# EAGLE design struktable_trigger_shield_revc (EAGLE 5.06)
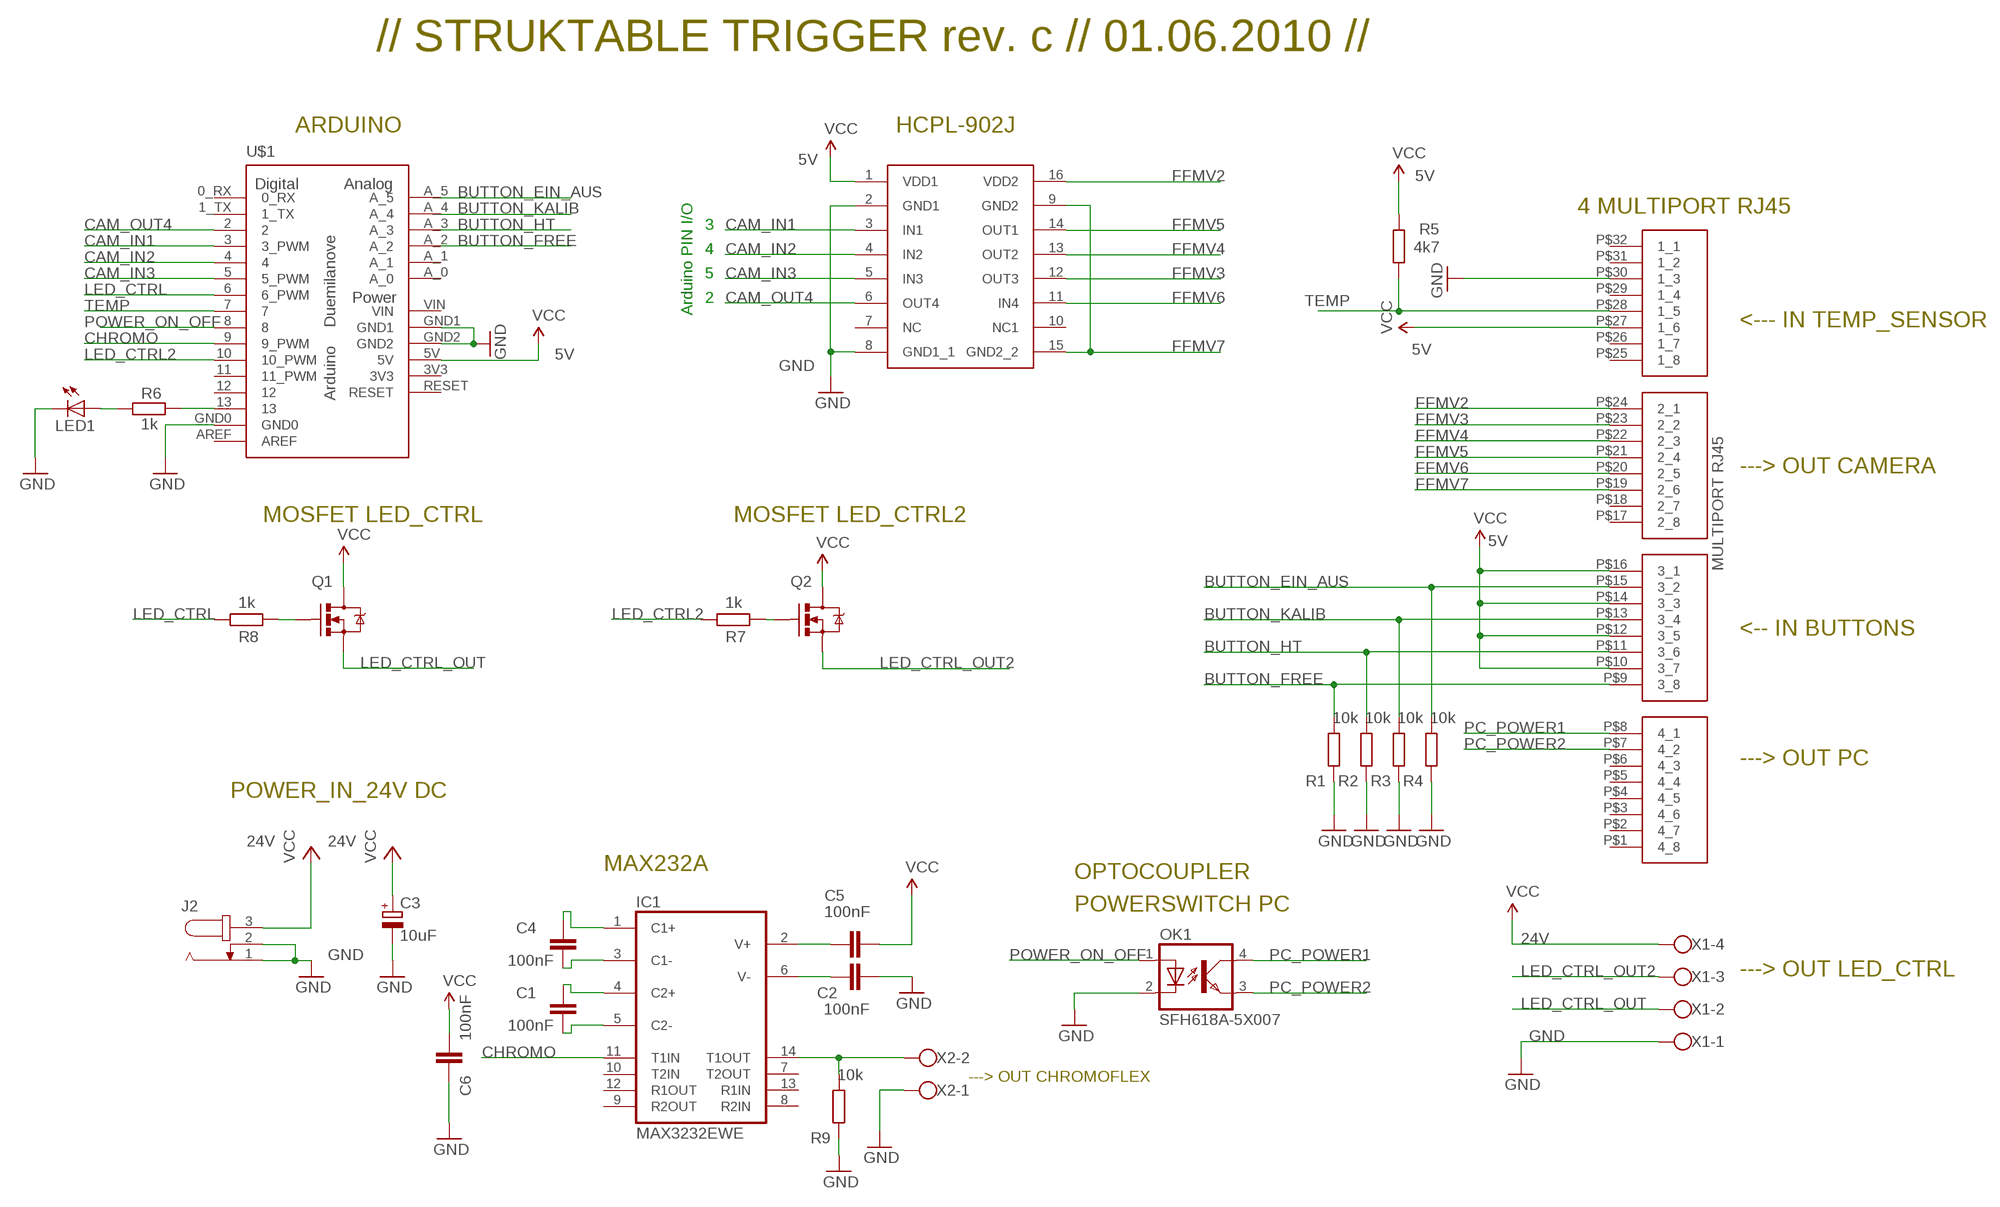
[diagram p0: schematic, sheet 1]

## Parts
C1  100nF  C-EUC0805  [C0805]
C2  100nF  C-EUC0805  [C0805]
C3  10uF  CPOL-EUSMCC  [SMC_C]
C4  100nF  C-EUC0805  [C0805]
C5  100nF  C-EUC0805  [C0805]
C6  100nF  C-EUC0805  [C0805]
IC1  MAX3232EWE  [SO16L]
IC2  HCPL-902J  [SOIC16]
J2  JACK-PLUG0  [SPC4077]
LED1  LED0603  [LED-0603]
OK1  SFH618A-5X007  [SMD4-7]
PORT1  4PORT_ETHERNET  [4PORT_ETHERNET]
Q1  MOSFET-NCHANNELSMD  [SOT23-3]
Q2  MOSFET-NCHANNELSMD  [SOT23-3]
R1  10k  R-EU_R0805  [R0805]
R2  10k  R-EU_R0805  [R0805]
R3  10k  R-EU_R0805  [R0805]
R4  10k  R-EU_R0805  [R0805]
R5  4k7  R-EU_R0805  [R0805]
R6  1k  R-EU_R0805  [R0805]
R7  1k  R-EU_R0805  [R0805]
R8  1k  R-EU_R0805  [R0805]
R9  10k  R-EU_R0805  [R0805]
U$1  ARDUINO-USBNO-OUTLINE-NO-TEXT-OCTAGONAL  [NO-OUTLINE-OCTAGONAL-NOTEXT]
X1  W237-04P  [W237-4P]
X2  W237-102  [W237-102]

## Nets
5V: C5.1 C6.2 IC2.1(VDD1) PORT1.P$10(3_7) PORT1.P$12(3_5) PORT1.P$14(3_3) PORT1.P$16(3_1) PORT1.P$27(1_6) Q1.3(D) Q2.3(D) R5.2 U$1.5V ; supply symbol labelled VCC
24V: C3.+ J2.3 X1.4 ; supply symbol labelled VCC
BUTTON_EIN_AUS: PORT1.P$15(3_2) R4.2 U$1.A_5
BUTTON_FREE: PORT1.P$9(3_8) R1.2 U$1.A_2
BUTTON_HT: PORT1.P$11(3_6) R2.2 U$1.A_3
BUTTON_KALIB: PORT1.P$13(3_4) R3.2 U$1.A_4
CAM_IN1: IC2.3(IN1) U$1.3(3_PWM)
CAM_IN2: IC2.4(IN2) U$1.4
CAM_IN3: IC2.5(IN3) U$1.5(5_PWM)
CAM_OUT4: IC2.6(OUT4) U$1.2
CHROMO: IC1.11(T1IN) U$1.9(9_PWM)
FFMV2: IC2.16(VDD2) PORT1.P$24(2_1)
FFMV3: IC2.12(OUT3) PORT1.P$23(2_2)
FFMV4: IC2.13(OUT2) PORT1.P$22(2_3)
FFMV5: IC2.14(OUT1) PORT1.P$21(2_4)
FFMV6: IC2.11(IN4) PORT1.P$20(2_5)
FFMV7: IC2.9(GND2) IC2.15(GND2_2) PORT1.P$19(2_6)
GND: C2.2 C3.- C6.1 IC2.2(GND1) IC2.8(GND1_1) J2.1 J2.2 LED1.C OK1.2(C) PORT1.P$30(1_3) R1.1 R2.1 R3.1 R4.1 R9.1 U$1.GND0 U$1.GND1 U$1.GND2 X1.1 X2.1
LED_CTRL: R8.2 U$1.6(6_PWM)
LED_CTRL2: R7.2 U$1.10(10_PWM)
LED_CTRL_OUT: Q1.2(S) X1.2
LED_CTRL_OUT2: Q2.2(S) X1.3
N$1: C4.1 IC1.1(C1+)
N$5: R6.1 U$1.13
N$6: LED1.A R6.2
N$10: Q2.1(G) R7.1
N$11: C5.2 IC1.2(V+)
N$15: C2.1 IC1.6(V-)
N$16: Q1.1(G) R8.1
N$17: C4.2 IC1.3(C1-)
N$18: C1.1 IC1.4(C2+)
N$19: C1.2 IC1.5(C2-)
N$20: IC1.14(T1OUT) R9.2 X2.2
PC_POWER1: OK1.4(COL) PORT1.P$8(4_1)
PC_POWER2: OK1.3(EMIT) PORT1.P$7(4_2)
POWER_ON_OFF: OK1.1(A) U$1.8
TEMP: PORT1.P$28(1_5) R5.1 U$1.7
Unconnected: IC1.7(T2OUT) IC1.8(R2IN) IC1.9(R2OUT) IC1.10(T2IN) IC1.12(R1OUT) IC1.13(R1IN) IC2.7(NC) IC2.10(NC1) PORT1.P$1(4_8) PORT1.P$2(4_7) PORT1.P$3(4_6) PORT1.P$4(4_5) PORT1.P$5(4_4) PORT1.P$6(4_3) PORT1.P$17(2_8) PORT1.P$18(2_7) PORT1.P$25(1_8) PORT1.P$26(1_7) PORT1.P$29(1_4) PORT1.P$31(1_2) PORT1.P$32(1_1) U$1.0_RX U$1.1_TX U$1.11(11_PWM) U$1.12 U$1.A_0 U$1.A_1 U$1.AREF U$1.RESET

## Notes on the sheet
- // STRUKTABLE TRIGGER rev. c // 01.06.2010 //
- ARDUINO | HCPL-902J
- 4 MULTIPORT RJ45
- 3
- 4
- 5
- 2
- Arduino PIN I/O
- <--- IN TEMP_SENSOR
- ---> OUT CAMERA
- MOSFET LED_CTRL | MOSFET LED_CTRL2
- <-- IN BUTTONS
- ---> OUT PC
- POWER_IN_24V DC
- MAX232A
- OPTOCOUPLER
- POWERSWITCH PC
- ---> OUT LED_CTRL
- ---> OUT CHROMOFLEX

## Power pins joined to a net without a drawn wire
3V3: U$1.3V3
24V: IC1.16(VCC)
GND: IC1.15(GND)
VIN: U$1.VIN

## Library data of the parts
C1 C2 C4-C6 = rcl:C-EU: CAPACITOR, European symbol
C3 = rcl:CPOL-EU: POLARIZED CAPACITOR, European symbol
IC1 = maxim:MAX3232*: True RS-232 Transceivers 3.0V to 5.5V, Low-Power up to 1Mbps, Using Four 0.1µF External Capacitors Source: http://pdfserv.maxim-ic.com/en/ds/MAX3222-MAX3241.pdf
IC2 = strukt:HCPL-902J
J2 = con-jack:JACK-PLUG: DC POWER JACK Power Jack, DC, Right Angle, Through Hole, Rated 5A at 16VDC, PC Terminals Distributor: Farnell (www.Farnell.de) Drawing: 84N1161.pdf / 84N1162.pdf Manufacturer: SPC Technology (www.spctechnology.com) Type: SPC4077 / SPC 4078
LED1 = SparkFun:LED: LEDs Standard schematic elements and footprints for 5mm, 3mm, 1206, and 0603 sized LEDs. 5mm - Spark Fun Electronics SKU : COM-00529 (and others)
OK1 = optocoupler:SFH618?*: Optocoupler, Phototransistor Output, Low Input Current Source: http://www.vishay.com/docs/83673/sfh618.pdf
PORT1 = strukt:4PORT_ETHERNET
Q1 Q2 = SparkFun:MOSFET-NCHANNEL
R1-R9 = rcl:R-EU_: RESISTOR, European symbol
U$1 = Arduino-Various:ARDUINO-USB: The Ardiuno Duemilanove Pinouts layoutet as a Bare Shield. v0.5 Also for Arduino Diecimila. This is designed as a Part and has no Outline in the Dimension Layer. The Outline, when present, is drawed at the tPlace / bPlace Layer. Library by Stephanie Lange, http://www.k-ita.de/~sl/
X1 = con-wago-508:W237-04P: WAGO SREW CLAMP
X2 = con-wago-500:W237-102: WAGO SCREW CLAMP

## Board
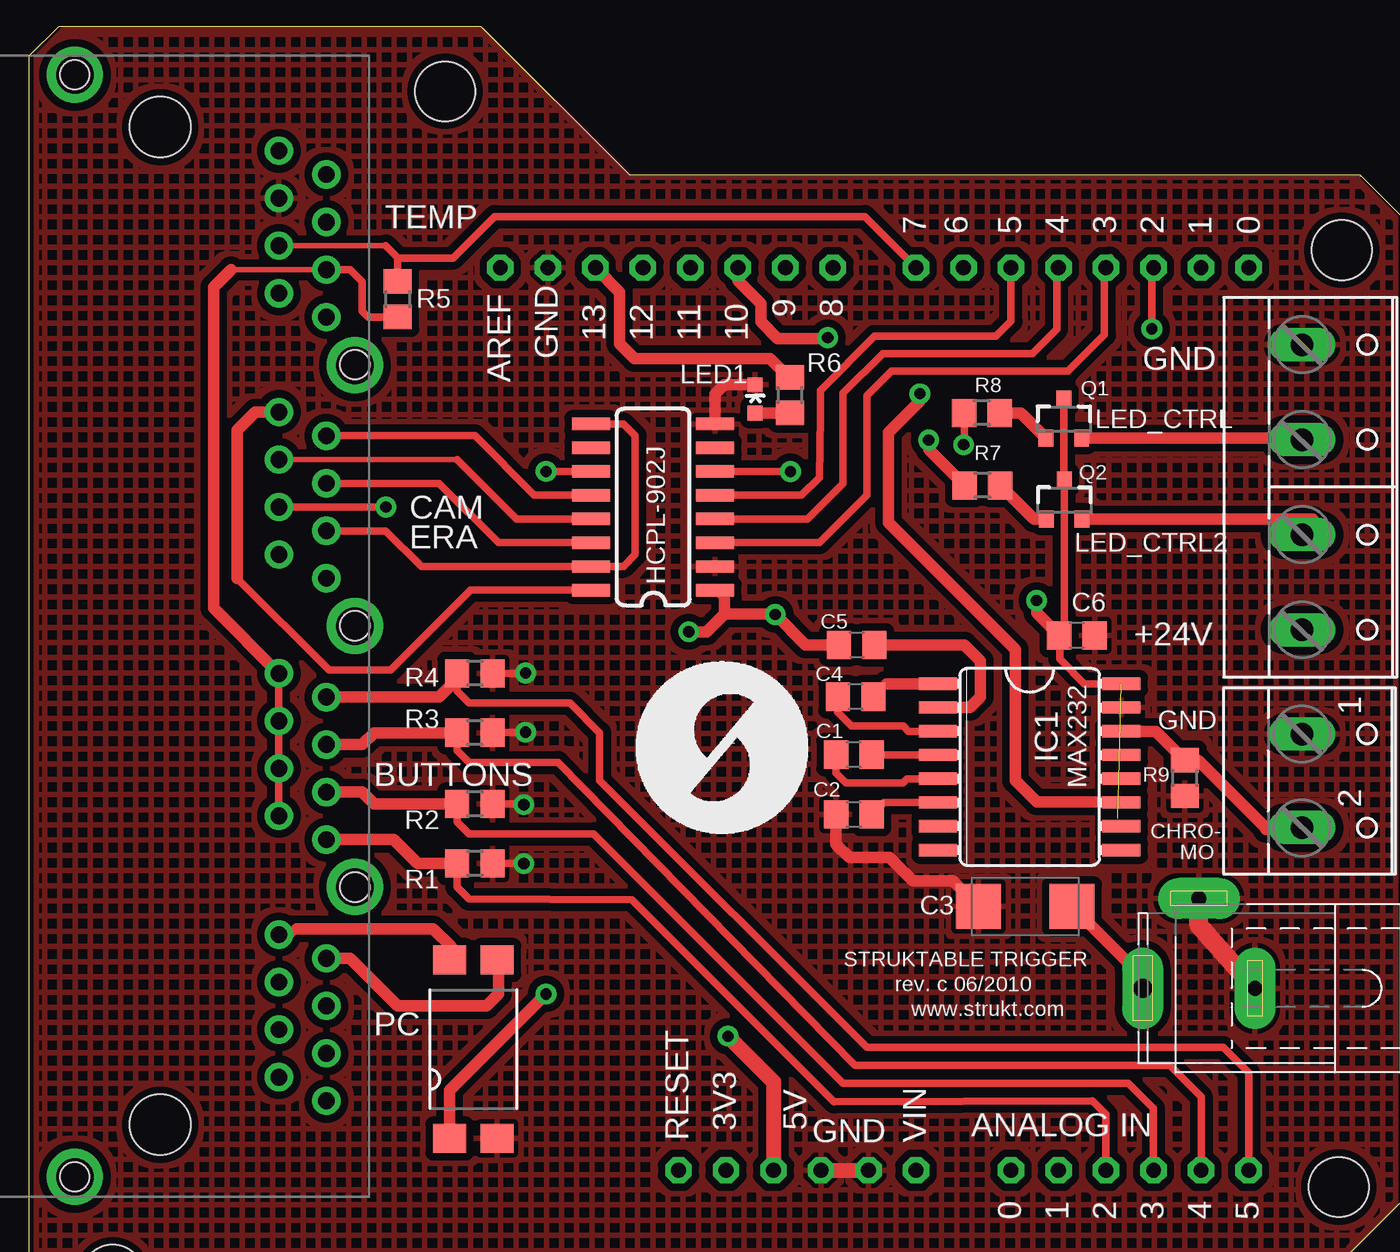
[diagram p1: board, top side]
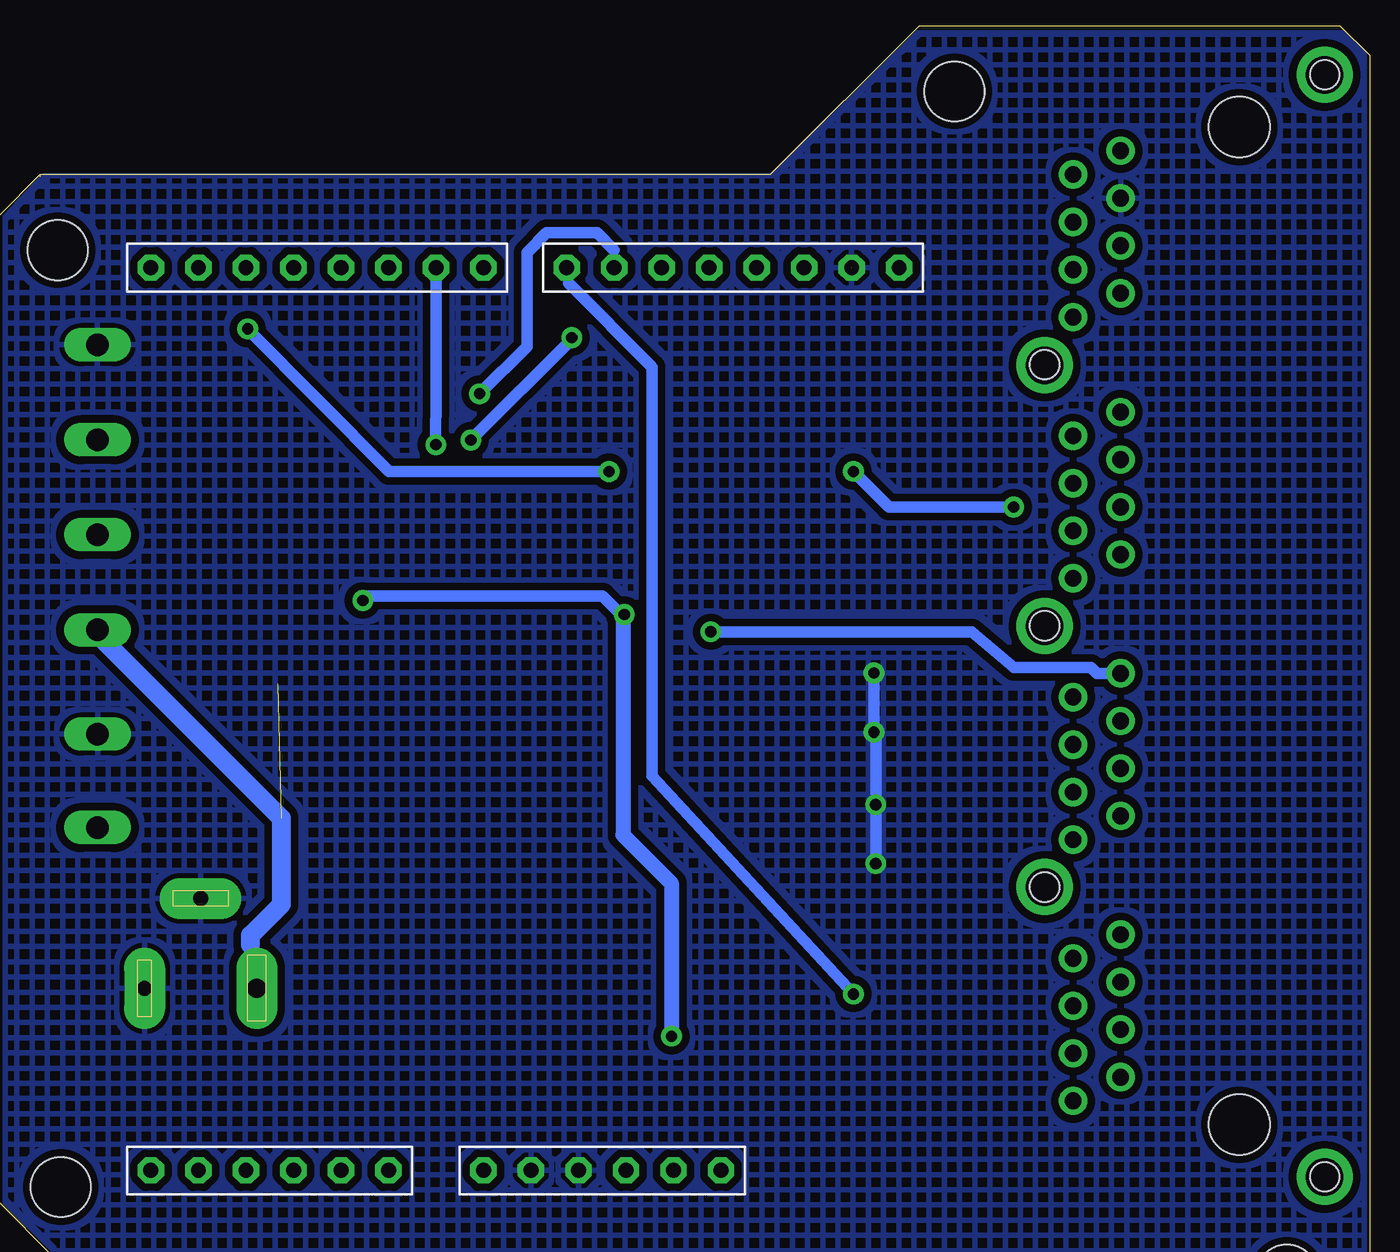
[diagram p2: board, bottom side, seen from below]

No outline drawn. Coordinates in mm, seen from the top.
Copper layers (1*16): Top 0.035mm / dielectric 1.5mm / Bottom 0.035mm
Design rules "SparkFun": minimum track width 8mil, minimum drill 20mil, track to track 8mil, track to pad 8mil, pad to pad 8mil, via to via 8mil, smd to smd 8mil, copper to edge 10mil, drill to drill 8mil, minimum pad ring 12mil, minimum via ring 10mil, stop-mask expansion 4mil, vias tented up to drill 25mil, thermal gap 10mil
Holes 3.2 mm at 22.23,66.04 70.17,57.55 70,7.46 4.45,2.78
Milling: 13 lines

### Footprints (pad centres in the part's own frame; a part is rotated, then mirrored left to right if it is on the bottom)
C0805 = smd 1.3 x 1.5: 1 -0.95,0; 2 0.95,0
SMC_C = smd 2.4 x 2.4: + -2.5,0; - 2.5,0
SO16L = smd 0.66 x 2.032: 1 -4.445,-4.902; 2 -3.175,-4.902; 3 -1.905,-4.902; 4 -0.635,-4.902; 5 0.635,-4.902; 6 1.905,-4.902; 7 3.175,-4.902; 8 4.445,-4.902; 9 4.445,4.902; 10 3.175,4.902; 11 1.905,4.902; 12 0.635,4.902; 13 -0.635,4.902; 14 -1.905,4.902; 15 -3.175,4.902; 16 -4.445,4.902
SOIC16 = smd 0.66 x 2.032: 1 -4.445,-3.315; 2 -3.175,-3.315; 3 -1.905,-3.315; 4 -0.635,-3.315; 5 0.635,-3.315; 6 1.905,-3.315; 7 3.175,-3.315; 8 4.445,-3.315; 9 4.445,3.315; 10 3.175,3.315; 11 1.905,3.315; 12 0.635,3.315; 13 -0.635,3.315; 14 -1.905,3.315; 15 -3.175,3.315; 16 -4.445,3.315
SPC4077 = drill 0.8 pad 2.184 long: 1 -3,0; 2 0,-4.8 | drill 1 pad 2.184 long: 3 3,0
LED-0603 = smd 0.8 x 0.8: A 0,-0.75; C 0,0.75
SMD4-7 = smd 1.78 x 1.55: 1 -1.27,-4.77; 2 1.27,-4.77; 3 1.27,4.77; 4 -1.27,4.77
4PORT_ETHERNET = drill 0.9 pad 1.422 round: P$1 25.4,8.89; P$2 24.13,6.35; P$3 22.86,8.89; P$4 21.59,6.35; P$5 20.32,8.89; P$6 19.05,6.35; P$7 17.78,8.89; P$8 16.51,6.35; P$9 11.43,8.89; P$10 10.16,6.35; P$11 8.89,8.89; P$12 7.62,6.35; P$13 6.35,8.89; P$14 5.08,6.35; P$15 3.81,8.89; P$16 2.54,6.35; P$17 -2.54,8.89; P$18 -3.81,6.35; P$19 -5.08,8.89; P$20 -6.35,6.35; P$21 -7.62,8.89; P$22 -8.89,6.35; P$23 -10.16,8.89; P$24 -11.43,6.35; P$25 -16.51,8.89; P$26 -17.78,6.35; P$27 -19.05,8.89; P$28 -20.32,6.35; P$29 -21.59,8.89; P$30 -22.86,6.35; P$31 -24.13,8.89; P$32 -25.4,6.35 | hole 3.25: -26.67,0; 26.67,0 | hole 1.57: -13.97,10.41; 0,10.41; 13.97,10.41; -29.46,-4.57; 29.46,-4.57
SOT23-3 = smd 0.8 x 0.9: 1 -0.95,-1; 2 0.95,-1; 3 0,1.1
R0805 = smd 1.3 x 1.5: 1 -0.95,0; 2 0.95,0
NO-OUTLINE-OCTAGONAL-NOTEXT = drill 0.8 pad 1.27 octagon: 0_RX -25.4,27.94; 1_TX -25.4,25.4; 2 -25.4,22.86; 3 -25.4,20.32; 3V3 22.86,0; 4 -25.4,17.78; 5 -25.4,15.24; 5V 22.86,2.54; 6 -25.4,12.7; 7 -25.4,10.16; 8 -25.4,5.715; 9 -25.4,3.175; 10 -25.4,0.635; 11 -25.4,-1.905; 12 -25.4,-4.445; 13 -25.4,-6.985; A_0 22.86,15.24; A_1 22.86,17.78; A_2 22.86,20.32; A_3 22.86,22.86; A_4 22.86,25.4; A_5 22.86,27.94; AREF -25.4,-12.065; GND0 -25.4,-9.525; GND1 22.86,7.62; GND2 22.86,5.08; RESET 22.86,-2.54; VIN 22.86,10.16
W237-4P = drill 1.194 long: 1 -7.62,-0.635; 2 -2.54,-0.635; 3 2.54,-0.635; 4 7.62,-0.635
W237-102 = drill 1.194 long: 1 -2.5,-1.27; 2 2.5,-1.27

### Placement (x,y rotation side)
C1  44.08,30.57 180 top
C2  44.08,27.38 180 top
C3  53.23,22.46 180 top
C4  44.17,33.67 180 top
C5  44.23,36.45 0 top
C6  56,36.95 180 top
IC1  53.48,29.93 270 top
IC2  33.34,43.81 90 top
J2  62.52,18.09 180 top
LED1  38.8,49.6 0 top
OK1  23.73,14.82 0 top
PORT1  6.99,37.47 270 top
Q1  55.3,48.5 0 top
Q2  55.33,44.17 0 top
R1  23.81,24.77 180 top
R2  23.81,27.94 180 top
R3  23.81,31.75 180 top
R4  23.81,34.92 180 top
R5  19.68,54.93 270 top
R6  40.65,49.8 270 top
R7  50.95,44.98 180 top
R8  50.92,48.85 180 top
R9  61.77,29.32 90 top
U$1  37.24,31.21 270 top
X1  68.67,44.88 270 top
X2  69.3,29.18 270 top

### Tracks (layer width: path | path; a pad name or v marks a point on that pad's centre or on a via)
5V  (via drill 0.6)
  Top 0.305: 10.79,56.52 PORT1.P$27
  Top 0.406: PORT1.P$10 PORT1.P$12 PORT1.P$14 PORT1.P$16 13.02,34.61 | 37.15,38.88 IC2.1 | R5.2 18.09,53.98 17.78,54.29 17.78,55.88 17.14,56.52 PORT1.P$27 | Q1.3 55.3,45.3 Q2.3 55.33,37.23 C6.2
  Top 0.61: PORT1.P$16 9.84,38.42 9.84,55.56 10.79,56.52 | v35.24,37.15 36.2,37.15 37.15,38.1 | 37.15,38.1 37.15,38.88 | 37.15,38.1 39.85,38.1 v39.88,38.08 41.5,36.45 C5.1 | v53.85,38.83 53.85,38.15 C6.2
  Top 0.813: U$1.5V 39.78,13.1 v37.35,15.53
  Bottom 0.406: v39.88,38.08 40.05,38.08 | 53.62,39.05 v53.85,38.83
  Bottom 0.61: PORT1.P$16 14.61,34.92 14.92,35.24 19.05,35.24 21.27,37.15 v35.24,37.15 | v39.88,38.08 39.95,38 | 40.05,38.08 41.02,39.05 53.62,39.05
  Bottom 0.813: v37.35,15.53 37.35,23.7 39.95,26.3 39.95,38
24V  (1 unrouted)
  Top 0.406: 59.43,18.36 J2.3 | IC1.16 56.41,34.37 55.08,35.7 55.08,36.83 54.98,36.92
  Top 0.61: 59.43,18.36 59.43,18.77 C3.+
  Bottom 0.61: 68.15,37.12 69.46,37.12 X1.4
  Bottom 0.813: J2.3 59.85,20.41
  Bottom 1.016: 59.85,20.41 59.85,20.93 58.2,22.57 58.2,27.18 68.15,37.12
BUTTON_EIN_AUS
  Top 0.406: R4.2 23.18,34.92 R4.2 | U$1.A_5 65.18,13.56 63.82,14.92 44.77,14.92 30.48,29.21 30.48,31.75 28.89,33.34 23.5,33.34 22.86,33.97 R4.2
  Top 0.61: PORT1.P$15 21.91,33.66 23.18,34.92
BUTTON_FREE
  Top 0.406: 23.18,24.77 R1.2 22.86,23.5 23.5,22.86 32.22,22.81 43.01,12.02 56.83,12.06 57.56,11.34 U$1.A_2
  Top 0.61: PORT1.P$9 19.48,26.04 20.75,24.77 R1.2
BUTTON_HT
  Top 0.406: U$1.A_3 60.1,11.66 58.74,13.02 43.5,13.02 30.16,26.35 23.5,26.35 22.86,26.99 22.86,27.62 23.18,27.94 R2.2
  Top 0.61: PORT1.P$11 17.78,28.57 18.41,27.94 R2.2
BUTTON_KALIB
  Top 0.406: U$1.A_4 62.64,12.29 60.96,13.97 44.13,13.97 28.26,30.16 23.5,30.16 22.86,30.8 22.86,31.43 23.18,31.75 R3.2
  Top 0.61: PORT1.P$13 17.78,31.11 18.41,31.75 R3.2
CAM_IN1
  Top 0.406: IC2.3 42.23,41.91 44.77,44.45 44.77,49.77 46.08,51.08 55.52,51.08 57.47,53.02 57.47,56.83 57.78,57.15 57.78,56.52 57.69,56.62 U$1.3
CAM_IN2
  Top 0.406: IC2.4 41.59,43.18 43.5,45.09 43.5,49.9 45.62,52.02 53.61,52.02 54.93,53.34 54.93,56.2 55.24,56.52 55.15,56.62 U$1.4
CAM_IN3
  Top 0.406: U$1.5 52.48,53.75 51.68,52.95 45.17,52.95 42.28,50.05 42.28,48.69 42.23,45.4 41.27,44.45 IC2.5 38.1,44.45
CAM_OUT4  (via drill 0.6)
  Top 0.406: IC2.6 40.64,45.72 v40.68,45.71 | v60.01,53.34 60.01,56.52 U$1.2
  Bottom 0.61: v40.68,45.71 52.43,45.71 v60.01,53.34
CHROMO  (via drill 0.6)
  Top 0.406: 47.6,49.48 v47.6,49.88 | IC1.11 58.35,28.05
  Top 0.61: 47.6,49.48 45.92,47.8 45.92,42.98 52.7,36.2 52.7,29.21 53.87,28.05 58.35,28.05
  Bottom 0.406: 40.41,57.56 U$1.9
  Bottom 0.61: 40.41,57.56 41.33,58.48 44.02,58.48 45.08,57.42 45.08,52.4 v47.6,49.88
FFMV2
  Top 0.406: 12.7,48.9 PORT1.P$24 | IC2.16 23.57,39.37 19.3,35.1 16.02,35.1 11.11,40.01
  Top 0.61: 12.7,48.9 12.06,48.9 11.11,47.94 11.11,40.01
FFMV3
  Top 0.406: PORT1.P$23 23.81,47.62 26.99,44.45 IC2.12 28.89,44.45
FFMV4
  Top 0.305: PORT1.P$22 22.86,46.35
  Top 0.406: IC2.13 26.04,43.18 22.86,46.35
FFMV5
  Top 0.406: PORT1.P$21 21.91,45.09 25.08,41.91 IC2.14
FFMV6  (via drill 0.6)
  Top 0.406: PORT1.P$20 v19.05,43.81 | v27.62,45.72 IC2.11
  Bottom 0.61: v19.05,43.81 25.72,43.81 v27.62,45.72
FFMV7
  Top 0.406: PORT1.P$19 19.05,42.55 20.95,40.64 IC2.15 31.75,40.64 32.38,41.27 32.38,47.62 31.75,48.26 IC2.9
GND  (via drill 0.6)  (1 unrouted)
  Top 0.406: IC2.2 36.51,40.64 | OK1.2 25,9.61 | 42.32,8.35 42.23,8.26 | U$1.GND2 42.32,8.35 | 42.32,8.35 U$1.GND2 | 27.62,56.52 U$1.GND0 | 44.85,8.35 U$1.GND1 | R4.1 26.5,34.92 v26.52,34.95 | v26.52,31.77 24.79,31.77 R3.1 | R2.1 26.39,27.94 v26.43,27.9 | R1.1 26.41,24.77 v26.43,24.75
  Top 0.61: LED1.C 37.15,50.35 36.65,49.85 IC2.8 | C2.2 43.12,25.77 43.83,25.07 45.98,25.07 47.23,23.82 49.38,23.82 C3.-
  Top 0.813: 42.32,8.35 44.85,8.35
  Top 1.016: J2.2 62.52,21.46 J2.1
  Bottom 0.406: 26.43,31.68 v26.52,31.77
  Bottom 0.61: v26.52,31.77 v26.52,34.95 | 26.43,31.68 v26.43,27.9 v26.43,24.75
  pour Bottom (isolate 0.406, hatched): 24.16,69.17 31.9,61.55 70.9,61.55 72.98,59.34 72.98,6.68 70.18,3.88 10.88,3.88 7.2,0.2 1.48,0.2 0.32,1.36 0.32,68 1.48,69.17
  pour Top (isolate 0.406, hatched): 1.93,69.3 24.2,69.3 32.05,61.45 70.88,61.45 73.05,59.27 73.05,6.58 70.22,3.75 10.55,3.75 6.92,0.12 1.48,0.12 0.35,1.25 0.35,67.85 1.82,69.33
LED_CTRL  (via drill 0.6)
  Top 0.406: R8.2 49.98,47.17 v49.95,47.15
  Bottom 0.61: U$1.6 49.94,50.04 v49.95,47.15
LED_CTRL2  (via drill 0.6)
  Top 0.406: 37.87,55.93 U$1.10 | 42.62,52.83 v42.67,52.88 | v48.08,47.4 48.08,46.9
  Top 0.61: 37.87,55.93 39.1,54.7 39.1,53.73 40,52.83 42.62,52.83 | 48.08,46.9 R7.2
  Bottom 0.406: v42.67,52.88 42.67,52.8
  Bottom 0.61: 42.67,52.8 v48.08,47.4
LED_CTRL_OUT
  Top 0.406: 69.36,47.5 X1.2
  Top 0.61: Q1.2 69.36,47.5
LED_CTRL_OUT2
  Top 0.61: Q2.2 68.6,43.17 X1.3
N$1
  Top 0.406: C4.1 45.82,34.37
  Top 0.61: 45.82,34.37 IC1.1
N$2  (via drill 2)
  other vias: 17.4,51.4
N$3  (via drill 2)
  other vias: 17.4,23.5
N$4  (via drill 2)
  other vias: 17.4,37.45
N$5
  Top 0.61: R6.1 40.6,50.75 39.6,51.75 32.35,51.75 31.55,52.55 31.55,55.32 U$1.13
N$6
  Top 0.61: LED1.A R6.2
N$7  (via drill 2)
  other vias: 2.42,66.92
N$8  (via drill 2)
  other vias: 2.42,8
N$10
  Top 0.61: Q2.1 53.7,43.17 R7.1
N$11
  Top 0.61: IC1.2 50.27,33.1 50.85,33.67 50.85,35.58 49.98,36.45 C5.2
N$15
  Top 0.406: IC1.6 45.67,28.02 C2.1
N$16
  Top 0.61: R8.1 53,48.85 Q1.1
N$17
  Top 0.406: IC1.3 46.99,31.83 46.73,32.1 43.95,32.1 43.2,32.85 43.2,33.65 C4.2
N$18
  Top 0.406: IC1.4 C1.1
N$19
  Top 0.406: IC1.5 46.91,29.29 46.7,29.07 43.65,29.07 43.12,29.6 C1.2
N$20
  Top 0.61: 66.19,26.58 X2.2 | 66.19,26.58 66.1,26.57 | 66.19,26.58 62.49,30.27 R9.2 60.22,31.83 IC1.14
PC_POWER1
  Top 0.406: PORT1.P$8 13.97,20.95 14.29,21.27 | OK1.4 22.46,19.61 22.54,19.68 22.54,20.32
  Top 0.61: 14.29,21.27 21.59,21.27 22.54,20.32
PC_POWER2
  Top 0.406: 25.08,19.68 25,19.61 OK1.3
  Top 0.61: PORT1.P$7 17.14,19.68 19.68,17.14 24.45,17.14 25.08,17.78 25.08,19.68
POWER_ON_OFF  (via drill 0.6)
  Top 0.61: OK1.1 22.46,12.62 v27.62,17.78
  Bottom 0.406: U$1.8 42.86,56.52 42.86,55.79 | 38.38,50.07 38.38,50.08
  Bottom 0.61: 38.38,50.07 38.38,29.43 v27.62,17.78 | 42.86,55.79 38.38,51.3 38.38,50.08
TEMP
  Top 0.305: PORT1.P$28 19.05,57.78
  Top 0.406: 19.05,57.78 19.68,57.15 R5.1 19.68,57.03 19.77,57.12 22.65,57.12 24.88,59.35 44.66,59.35 U$1.7 47.06,56.62

### Text on the board
tNames: TEMP | 7 | 6 | 5 | 4 | 3 | 2 | 1 | 0 | 9 | 8 | 13 | 12 | 11 | 10 | GND | GND | AREF | Q1 | LED_CTRL | CAM | ERA | LED_CTRL2 | HCPL-902J | +24V | GND | BUTTONS | MAX232 | CHRO- | MO | STRUKTABLE TRIGGER | rev. c 06/2010 | www.strukt.com | PC | RESET | 3V3 | 5V | GND | ANALOG IN | VIN | 0 | 1 | 2 | 3 | 4 | 5
tValues: 24V DC IN
_tsilk: TEMP | 7 | 6 | 5 | 4 | 3 | 2 | 1 | 0 | R5 | 9 | 8 | 13 | 12 | 11 | 10 | GND | GND | LED1 | R6 | R8 | AREF | Q1 | LED_CTRL | R7 | Q2 | CAM | ERA | LED_CTRL2 | HCPL-902J | C6 | C5 | +24V | 10k | C4 | R4 | 1 | R3 | C1 | GND | IC1 | R9 | BUTTONS | C2 | MAX232 | 2 | R2 | CHRO- | MO | R1 | C3 | STRUKTABLE TRIGGER | rev. c 06/2010 | www.strukt.com | PC | RESET | 3V3 | 5V | 24V DC IN | GND | ANALOG IN | VIN | 0 | 1 | 2 | 3 | 4 | 5